# EAGLE design 7segement4digits1badidea-many-digits-mk-1.2 (EAGLE 6.5.0)
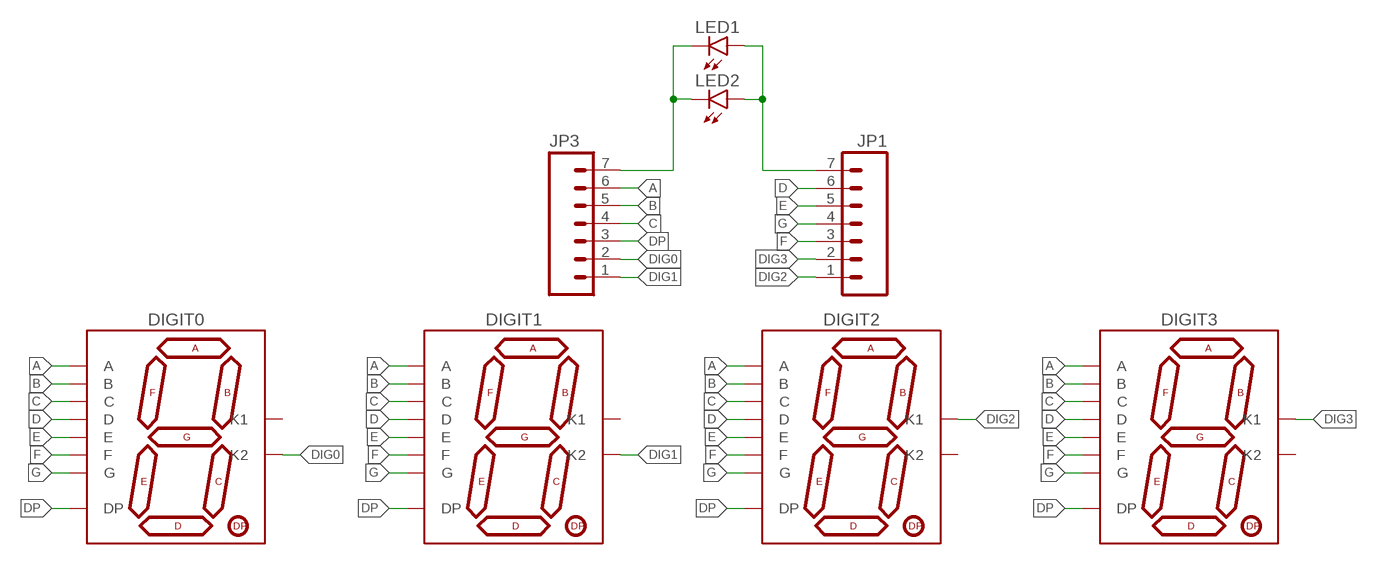
[diagram p0: schematic, sheet 1]

## Parts
DIGIT0  7SEG_1DIGPTH-10MM  [7SEG_1DIG_10MM]
DIGIT1  7SEG_1DIGPTH-10MM  [7SEG_1DIG_10MM]
DIGIT2  7SEG_1DIGPTH-10MM  [7SEG_1DIG_10MM]
DIGIT3  7SEG_1DIGPTH-10MM  [7SEG_1DIG_10MM]
JP1  M07  [1X07]
JP3  M07  [1X07]
LED1  LED3MM-LESS  [LED3MM-LESSSILK]
LED2  LED3MM-LESS  [LED3MM-LESSSILK]

## Nets
A: DIGIT0.10(A) DIGIT1.10(A) DIGIT2.10(A) DIGIT3.10(A) JP3.6
B: DIGIT0.9(B) DIGIT1.9(B) DIGIT2.9(B) DIGIT3.9(B) JP3.5
C: DIGIT0.8(C) DIGIT1.8(C) DIGIT2.8(C) DIGIT3.8(C) JP3.4
D: DIGIT0.5(D) DIGIT1.5(D) DIGIT2.5(D) DIGIT3.5(D) JP1.6
DIG0: DIGIT0.6(K2) JP3.2
DIG1: DIGIT1.6(K2) JP3.1
DIG2: DIGIT2.1(K1) JP1.1
DIG3: DIGIT3.1(K1) JP1.2
DP: DIGIT0.7(DP) DIGIT1.7(DP) DIGIT2.7(DP) DIGIT3.7(DP) JP3.3
E: DIGIT0.4(E) DIGIT1.4(E) DIGIT2.4(E) DIGIT3.4(E) JP1.5
F: DIGIT0.2(F) DIGIT1.2(F) DIGIT2.2(F) DIGIT3.2(F) JP1.3
G: DIGIT0.3(G) DIGIT1.3(G) DIGIT2.3(G) DIGIT3.3(G) JP1.4
N$2: JP3.7 LED1.K(C) LED2.K(C)
N$3: JP1.7 LED1.A LED2.A
Unconnected: DIGIT0.1(K1) DIGIT1.1(K1) DIGIT2.6(K2) DIGIT3.6(K2)

## Library data of the parts
DIGIT0 DIGIT1-DIGIT3 = A_butts:7SEG_1DIG
JP1 JP3 = A_butts:M07: Header 7 Standard 7-pin 0.1" header. Use with straight break away headers (SKU : PRT-00116), right angle break away headers (PRT-00553), swiss pins (PRT-00743), machine pins (PRT-00117), and female headers (PRT-00115). NOTES ON THE VARIANTS LOCK and LOCK_LONGPADS... This footprint was designed to help hold the alignment of a through-hole component (i.e. 7-pin header) while soldering it into place. You may notice that each hole has been shifted either up or down by 0.005 of an inch from it's more standard position (which is usually a perfectly straight line). This slight alteration caused the pins (the squares in the middle) to touch the edges of the holes. Because they are alternating, it causes a "brace" to hold the header in place. 0.005 has proven to be the perfect amount of "off-center" position when using our standard breakaway headers. Although looks a little odd when you look at the bare footprint, once you have a header in there, the alteration is very hard to notice. Also, if you push a header all the way into place, it is covered up entirely on the bottom side. This idea of altering the position of holes to aid alignment will be further integrated into the Sparkfun Library for other footprints. It can help hold any component with 3 or more connection pins.
LED1 LED2 = A_butts:LED: LEDs Standard schematic elements and footprints for 5mm, 3mm, 1206, and 0603 sized LEDs. 5mm - Spark Fun Electronics SKU : COM-00529 (and others)

## Board
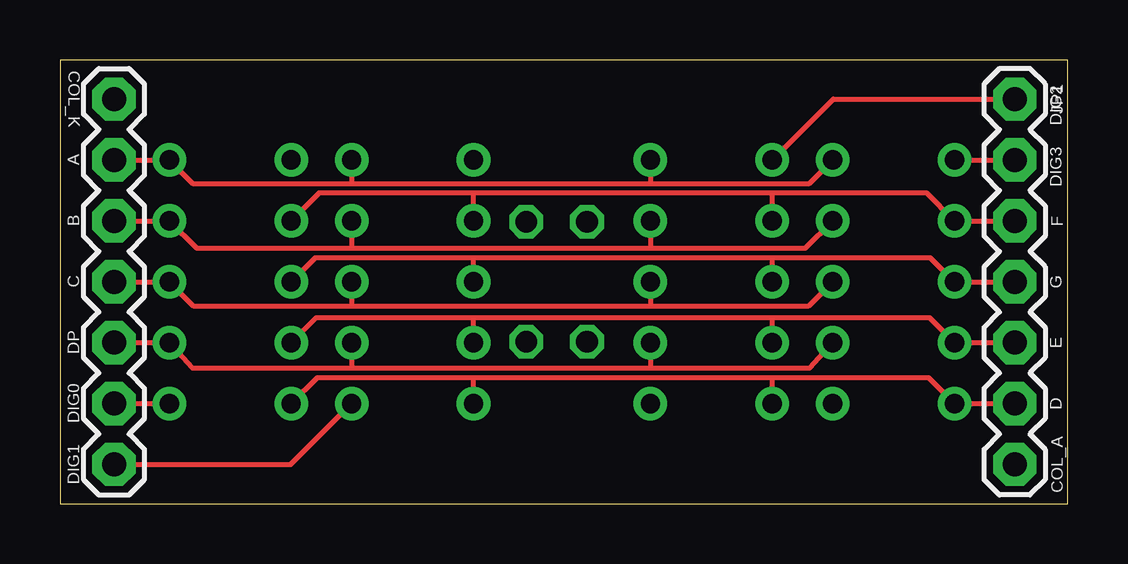
[diagram p1: board, top side]
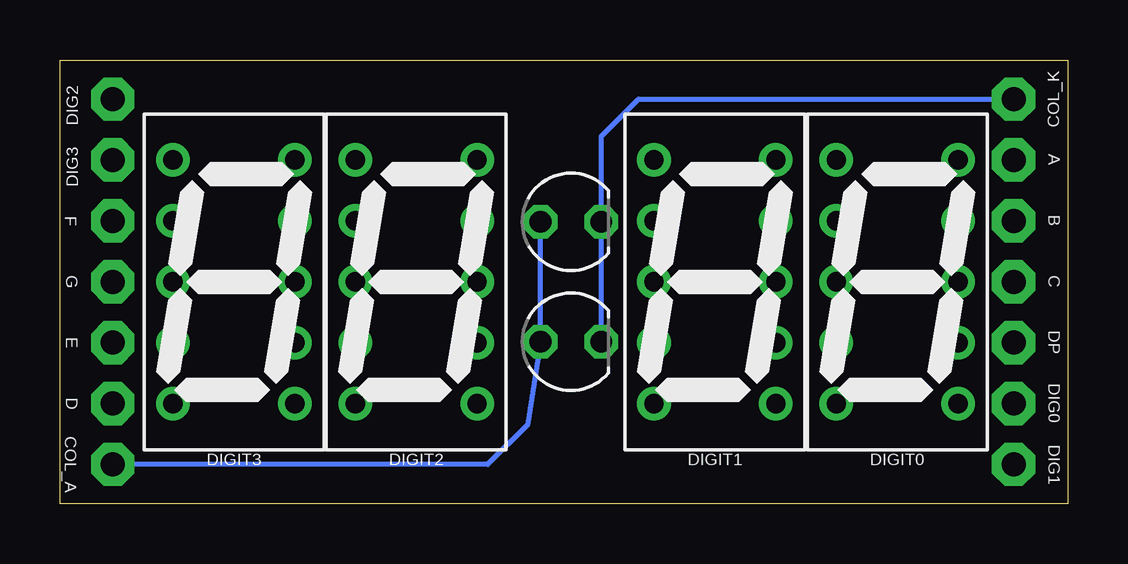
[diagram p2: board, bottom side, seen from below]

Size 42 x 18.5 mm. Coordinates in mm from the lower left corner, seen from the top.
Outline: 0,0 42,0 42,18.5 0,18.5 0,0
Copper layers (1*16): Top 0.0356mm / dielectric 1.5011mm / Bottom 0.0356mm
Design rules "LaenPCBOrder_2": minimum track width 6mil, minimum drill 13mil, track to track 6mil, track to pad 6mil, pad to pad 6mil, via to via 6mil, smd to smd 6mil, copper to edge 15mil, drill to drill 6mil, minimum pad ring 7mil, minimum via ring 7mil, stop-mask expansion 3mil, vias tented up to drill 20mil, thermal gap 10mil

### Footprints (pad centres in the part's own frame; a part is rotated, then mirrored left to right if it is on the bottom)
7SEG_1DIG_10MM = drill 0.8 pad 1.4: 1 -2.54,5.08; 2 -2.54,2.54; 3 -2.54,0; 4 -2.54,-2.54; 5 -2.54,-5.08; 6 2.54,-5.08; 7 2.54,-2.54; 8 2.54,0; 9 2.54,2.54; 10 2.54,5.08
1X07 = drill 1 pad 1.8 octagon: 1 0,0; 2 2.54,0; 3 5.08,0; 4 7.62,0; 5 10.16,0; 6 12.7,0; 7 15.24,0
LED3MM-LESSSILK = drill 0.9 pad 1.4 octagon: A -1.27,0; K 1.27,0

### Placement (x,y rotation side)
DIGIT0  7.1,9.25 0 bottom
DIGIT1  14.7,9.25 0 bottom
DIGIT2  27.15,9.25 0 bottom
DIGIT3  34.75,9.25 0 bottom
JP1  39.8,16.87 270 top
JP3  2.25,1.63 90 top
LED1  20.7,11.75 0 bottom
LED2  20.7,6.75 0 bottom

### Tracks (layer width: path | path; a pad name or v marks a point on that pad's centre or on a via)
A
  Top 0.2: 12.16,13.35 5.54,13.35 DIGIT0.10 JP3.6 | 12.16,13.35 24.61,13.35 | 24.61,13.35 31.23,13.35 DIGIT3.10 | DIGIT1.10 12.16,13.35 | DIGIT2.10 24.61,13.35
B
  Top 0.2: 12.16,10.65 5.7,10.65 DIGIT0.9 JP3.5 | 12.16,10.65 24.61,10.65 | 24.61,10.65 31.07,10.65 DIGIT3.9 | DIGIT1.9 12.16,10.65 | DIGIT2.9 24.61,10.65
C
  Top 0.2: 12.16,8.25 5.56,8.25 DIGIT0.8 JP3.4 | 12.16,8.25 24.61,8.25 | 24.61,8.25 31.21,8.25 DIGIT3.8 | DIGIT1.8 12.16,8.25 | DIGIT2.8 24.61,8.25
D
  Top 0.2: 29.69,5.25 36.21,5.25 DIGIT3.5 JP1.6 | 29.69,5.25 17.24,5.25 | 17.24,5.25 10.72,5.25 DIGIT0.5 | DIGIT2.5 29.69,5.25 | DIGIT1.5 17.24,5.25
DIG0
  Top 0.2: JP3.2 DIGIT0.6
DIG1
  Top 0.2: JP3.1 9.62,1.63 DIGIT1.6
DIG2
  Top 0.2: DIGIT2.1 32.23,16.87 JP1.1
DIG3
  Top 0.2: DIGIT3.1 JP1.2
DP
  Top 0.2: 12.16,5.65 5.52,5.65 DIGIT0.7 JP3.3 | 12.16,5.65 24.61,5.65 | 24.61,5.65 31.25,5.65 DIGIT3.7 | DIGIT2.7 24.61,5.65 | DIGIT1.7 12.16,5.65
E
  Top 0.2: 29.69,7.75 36.25,7.75 DIGIT3.4 JP1.5 | 29.69,7.75 17.24,7.75 | 17.24,7.75 10.68,7.75 DIGIT0.4 | DIGIT1.4 17.24,7.75 | DIGIT2.4 29.69,7.75
F
  Top 0.2: 29.69,12.95 36.13,12.95 DIGIT3.2 JP1.3 | 29.69,12.95 17.24,12.95 | 17.24,12.95 10.8,12.95 DIGIT0.2 | DIGIT1.2 17.24,12.95 | DIGIT2.2 29.69,12.95
G
  Top 0.2: 29.69,10.25 36.29,10.25 DIGIT3.3 JP1.4 | 29.69,10.25 17.24,10.25 | 17.24,10.25 10.64,10.25 DIGIT0.3 | DIGIT2.3 29.69,10.25 | DIGIT1.3 17.24,10.25
N$2
  Bottom 0.2: LED2.K LED1.K 19.43,15.32 17.88,16.87 JP3.7
N$3
  Bottom 0.2: LED1.A LED2.A 22.52,3.28 24.17,1.63 JP1.7

### Text on the board
tPlace: COL_K | DIG2 | A | DIG3 | B | F | C | G | DP | E | DIG0 | D | DIG1 | COL_A
bPlace: COL_K | DIG2 | A | DIG3 | B | F | C | G | DP | E | DIG0 | D | DIG1 | COL_A